# EAGLE schematic interfacez (EAGLE 6.4)
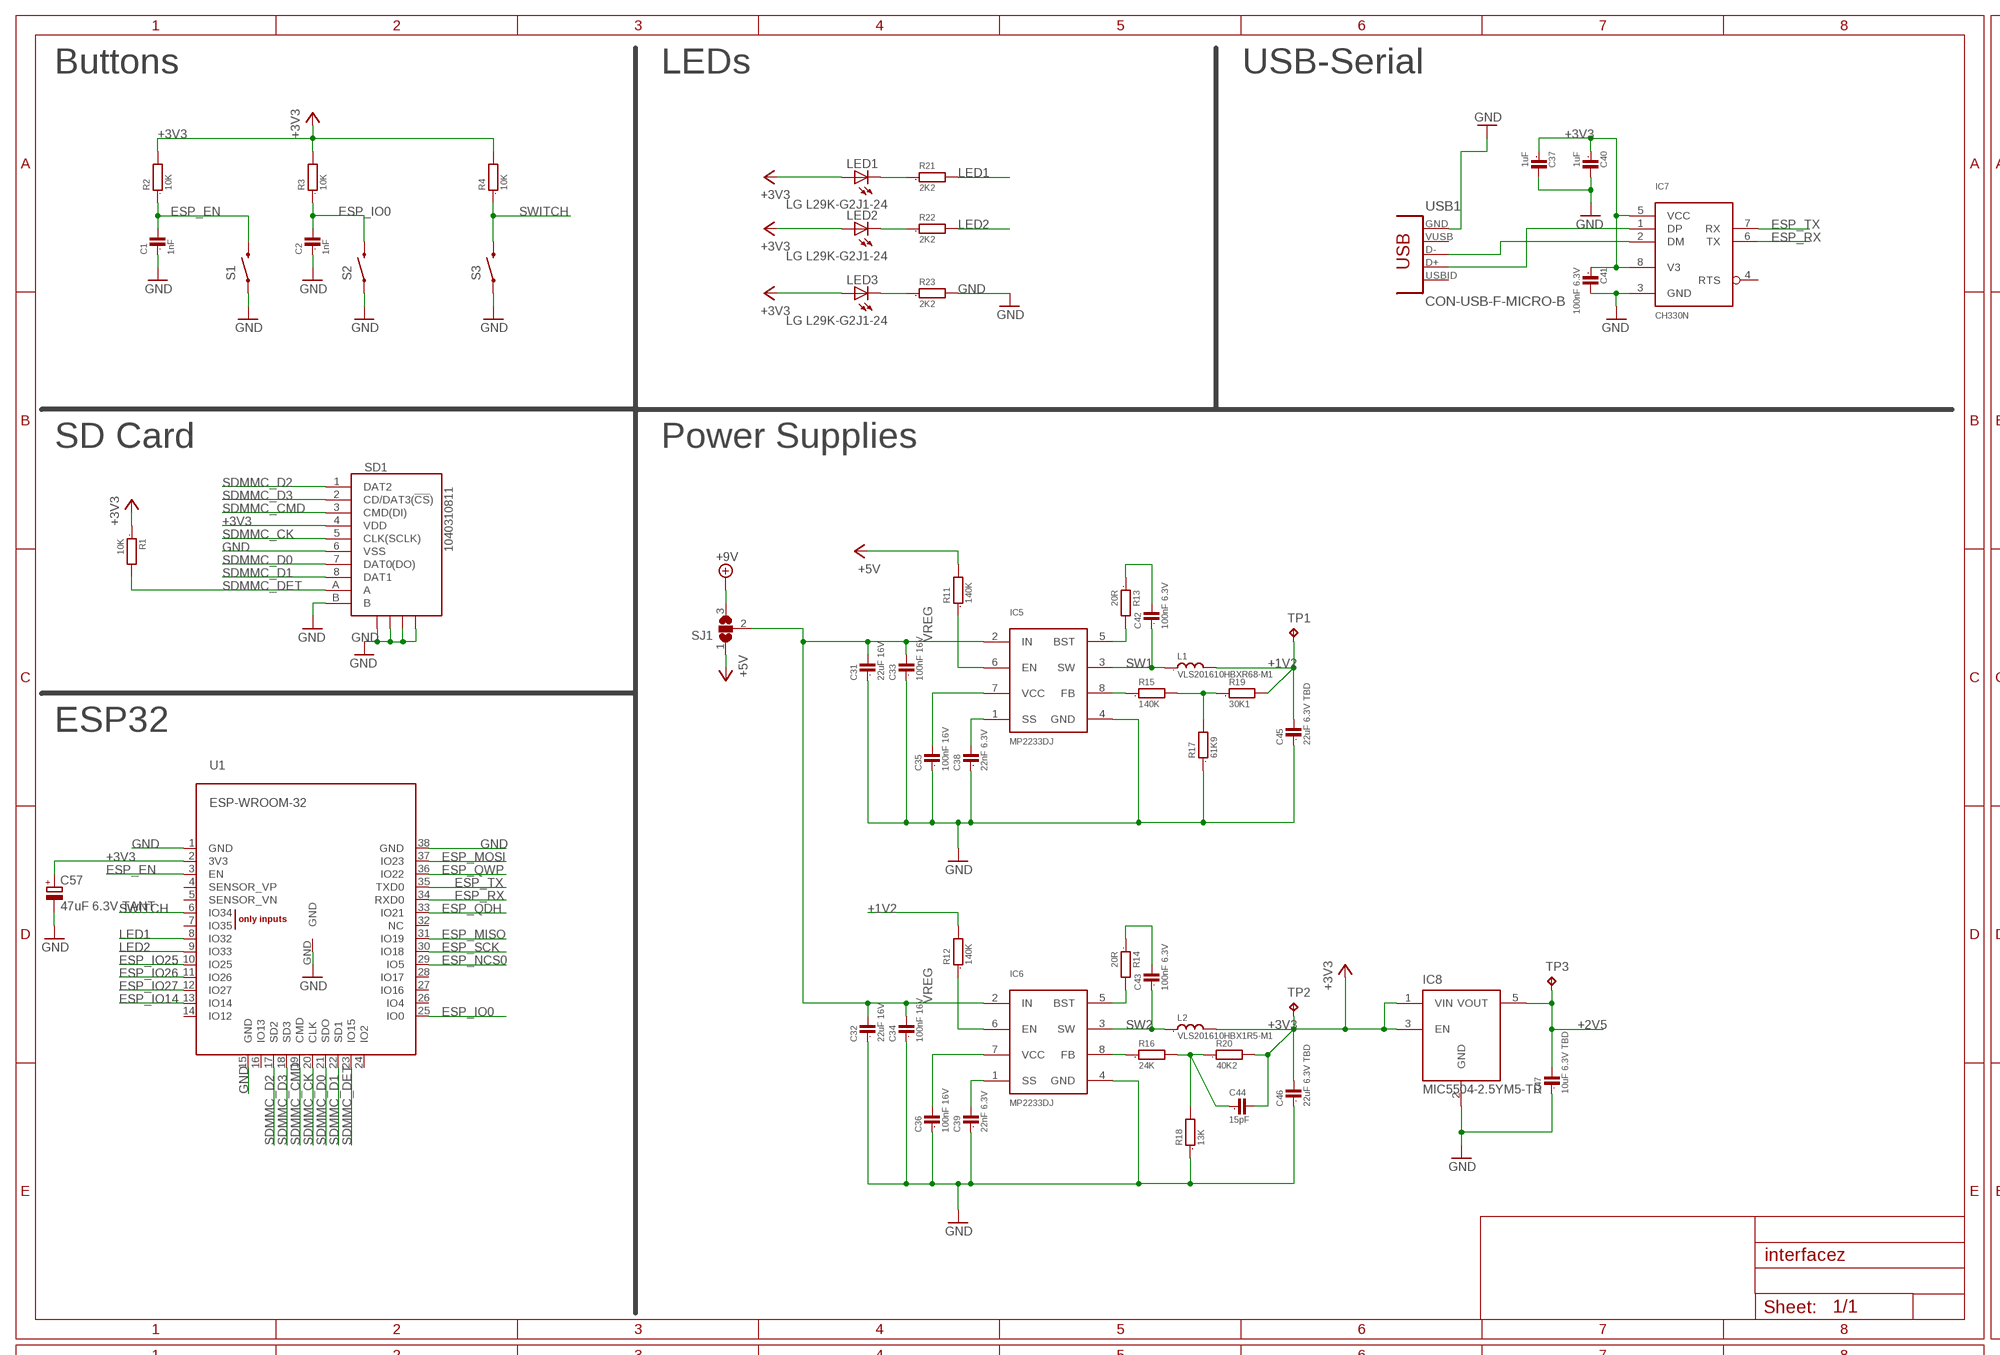
[diagram p0: schematic, sheet 1, part 1 of 3]
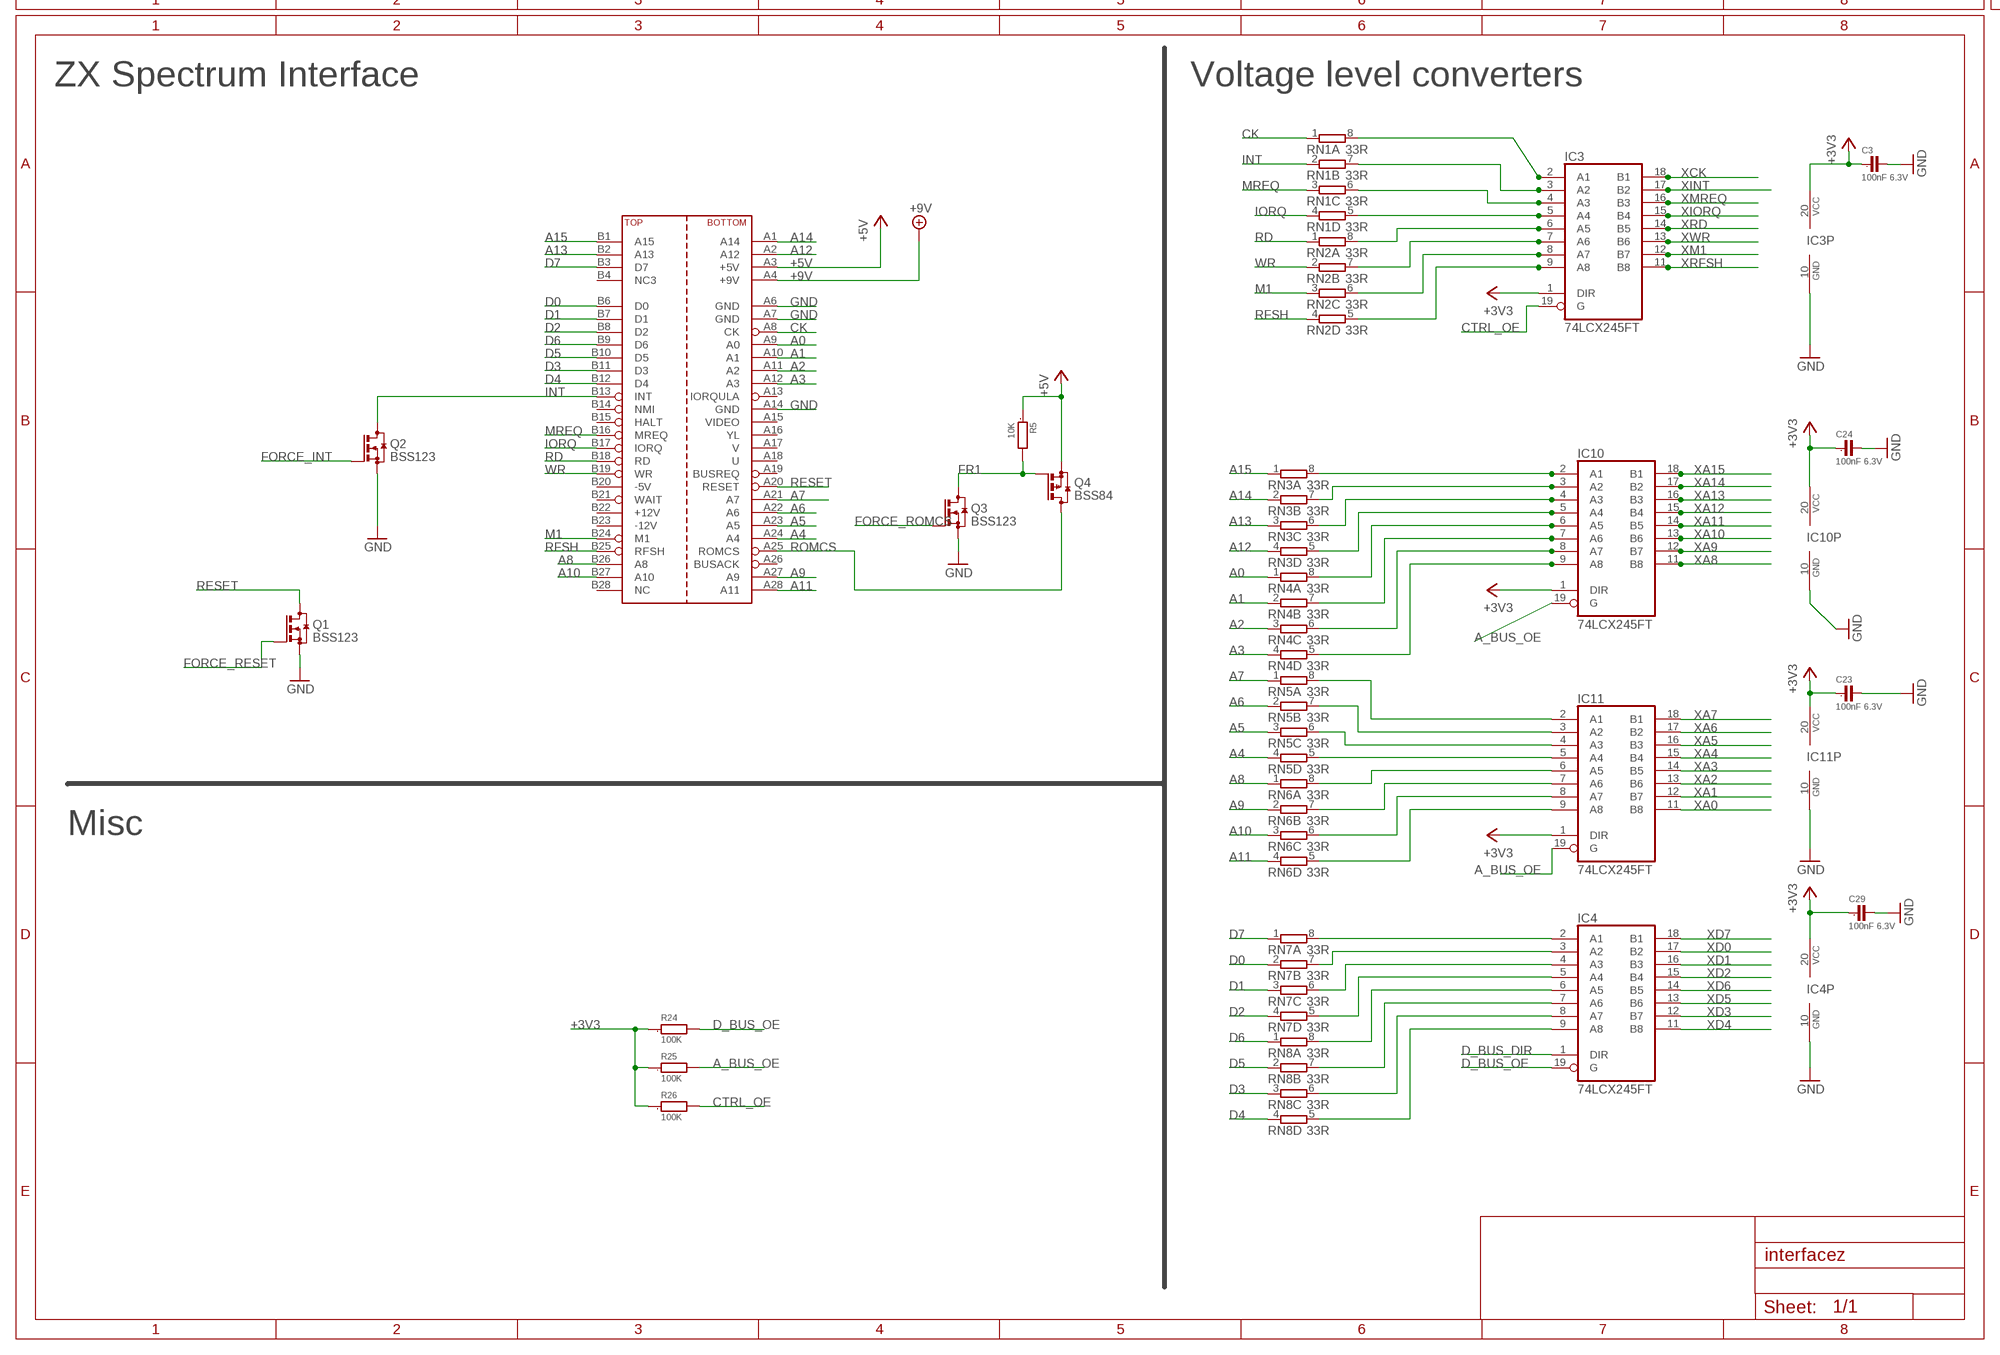
[diagram p1: schematic, sheet 1, part 2 of 3]
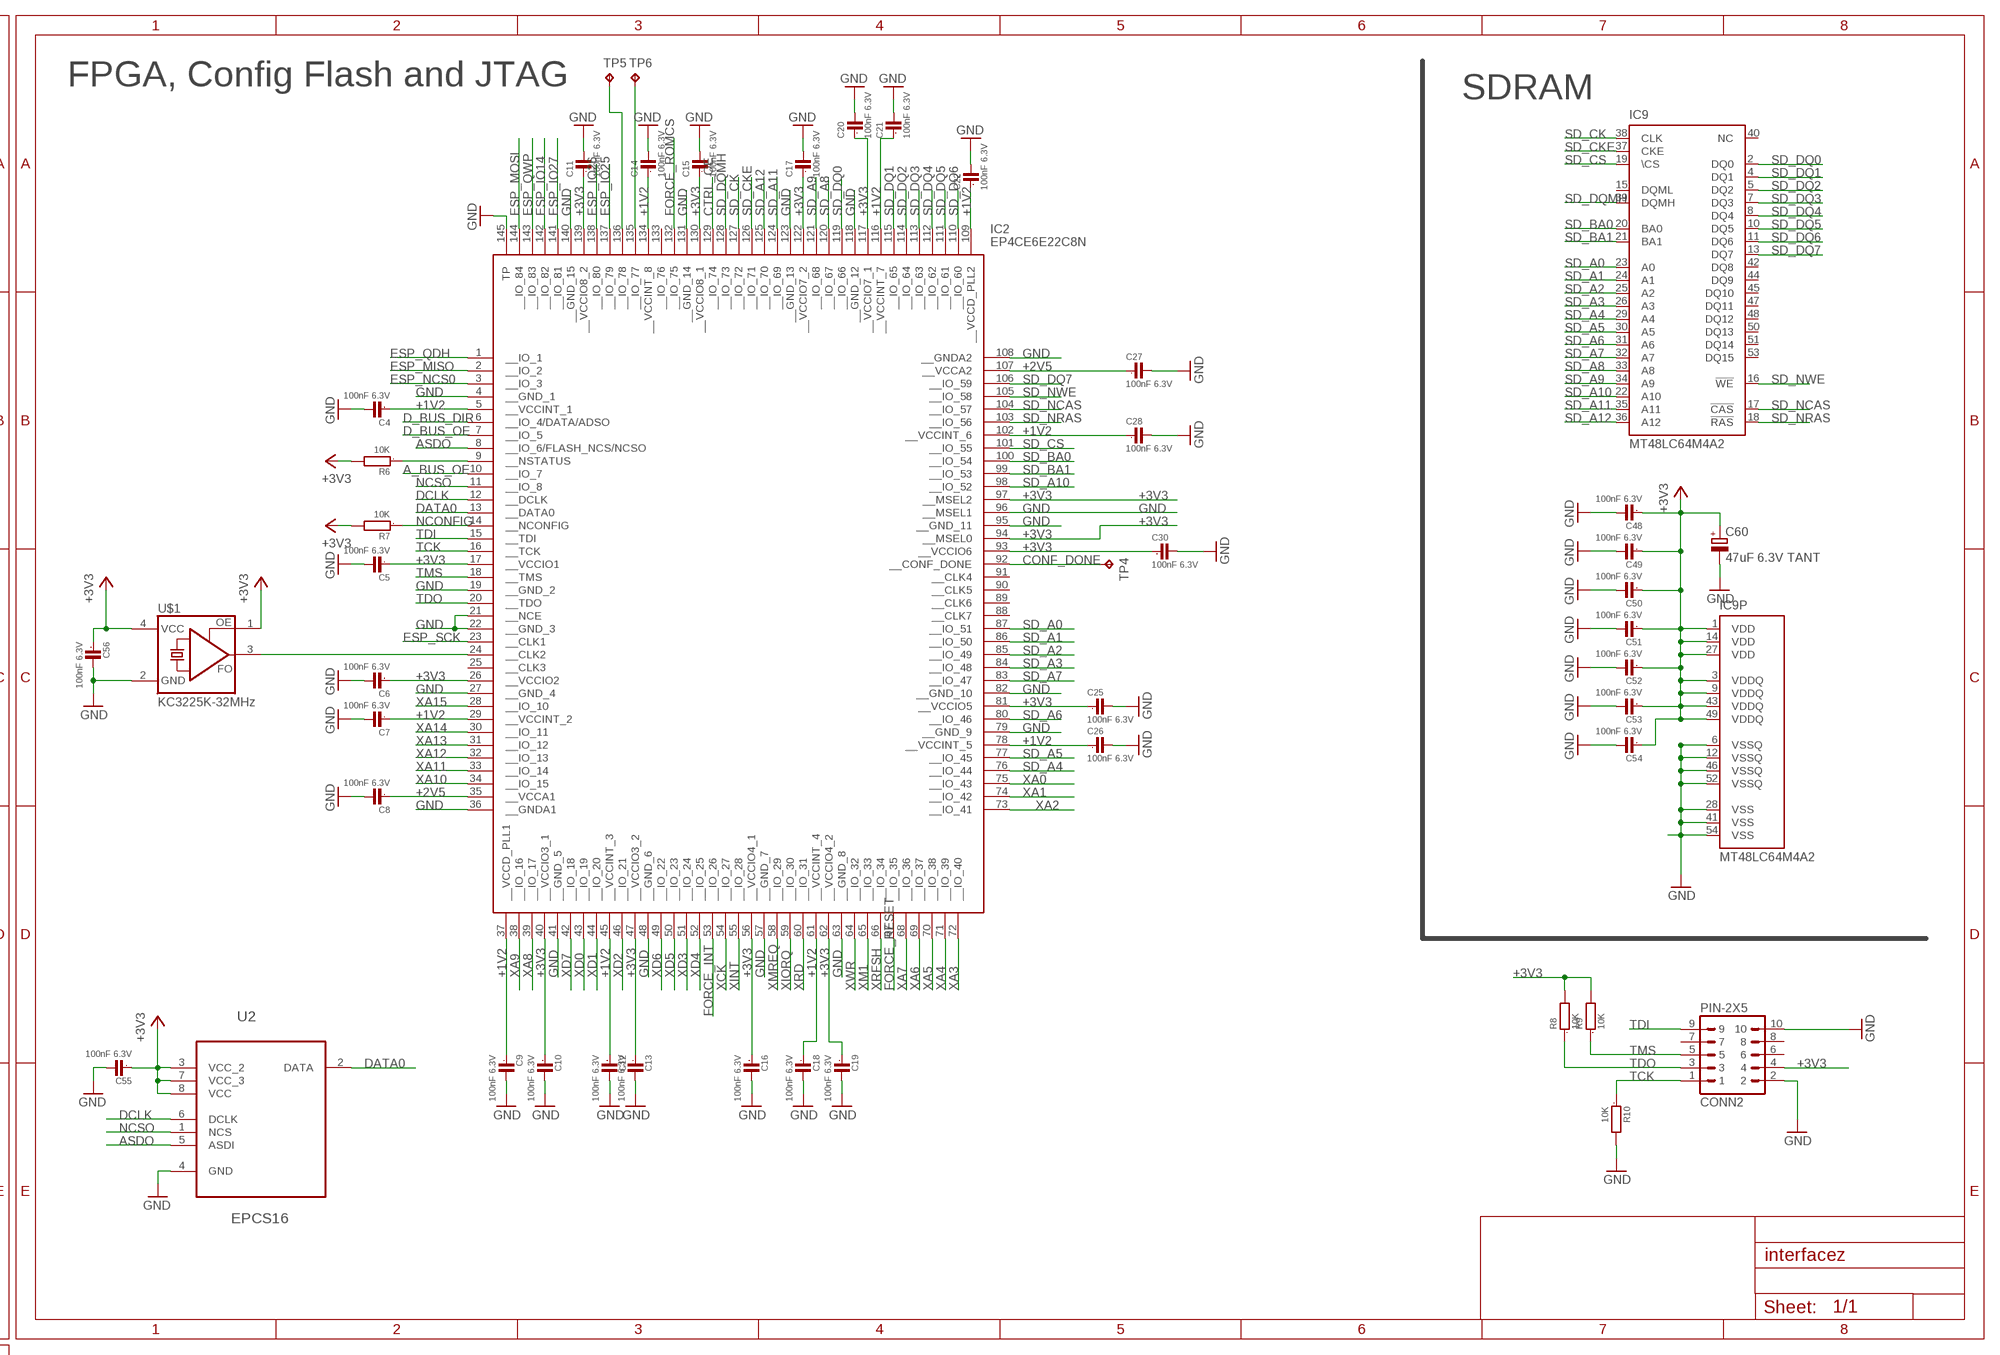
[diagram p2: schematic, sheet 1, part 3 of 3]

## Parts
C1  1nF  C0603  [0603]
C2  1nF  C0603  [0603]
C3  100nF 6.3V  C0603  [0603]
C4  100nF 6.3V  C0603  [0603]
C5  100nF 6.3V  C0603  [0603]
C6  100nF 6.3V  C0603  [0603]
C7  100nF 6.3V  C0603  [0603]
C8  100nF 6.3V  C0603  [0603]
C9  100nF 6.3V  C0603  [0603]
C10  100nF 6.3V  C0603  [0603]
C11  100nF 6.3V  C0603  [0603]
C12  100nF 6.3V  C0603  [0603]
C13  100nF 6.3V  C0603  [0603]
C14  100nF 6.3V  C0603  [0603]
C15  100nF 6.3V  C0603  [0603]
C16  100nF 6.3V  C0603  [0603]
C17  100nF 6.3V  C0603  [0603]
C18  100nF 6.3V  C0603  [0603]
C19  100nF 6.3V  C0603  [0603]
C20  100nF 6.3V  C0603  [0603]
C21  100nF 6.3V  C0603  [0603]
C22  100nF 6.3V  C0603  [0603]
C23  100nF 6.3V  C0603  [0603]
C24  100nF 6.3V  C0603  [0603]
C25  100nF 6.3V  C0603  [0603]
C26  100nF 6.3V  C0603  [0603]
C27  100nF 6.3V  C0603  [0603]
C28  100nF 6.3V  C0603  [0603]
C29  100nF 6.3V  C0603  [0603]
C30  100nF 6.3V  C0603  [0603]
C31  22uF 16V  C1210  [1210]
C32  22uF 16V  C1210  [1210]
C33  100nF 16V  C0603  [0603]
C34  100nF 16V  C0603  [0603]
C35  100nF 16V  C0603  [0603]
C36  100nF 16V  C0603  [0603]
C37  1uF  C0603  [0603]
C38  22nF 6.3V  C0603  [0603]
C39  22nF 6.3V  C0603  [0603]
C40  1uF  C0603  [0603]
C41  100nF 6.3V  C0603  [0603]
C42  100nF 6.3V  C0603  [0603]
C43  100nF 6.3V  C0603  [0603]
C44  15pF  C0603  [0603]
C45  22uF 6.3V TBD  C0805  [0805]
C46  22uF 6.3V TBD  C0805  [0805]
C47  10uF 6.3V TBD  C0805  [0805]
C48  100nF 6.3V  C0603  [0603]
C49  100nF 6.3V  C0603  [0603]
C50  100nF 6.3V  C0603  [0603]
C51  100nF 6.3V  C0603  [0603]
C52  100nF 6.3V  C0603  [0603]
C53  100nF 6.3V  C0603  [0603]
C54  100nF 6.3V  C0603  [0603]
C55  100nF 6.3V  C0603  [0603]
C56  100nF 6.3V  C0603  [0603]
C57  47uF 6.3V TANT  TANT_CASE_A  [TANT_CASE_A]
C60  47uF 6.3V TANT  TANT_CASE_A  [TANT_CASE_A]
CONN1  ZX_EDGE_DAUGHTERBOARD  [ZX-EDGE-DAUGHTERBOARD]
CONN2  PIN-2X5  [PIN-2X5]
IC2  EP4CE6E22C8N  [QFP50P2200X2200X165-145N]
IC3  74LCX245FT  74245  [TSSOP20]
IC4  74LCX245FT  74245  [TSSOP20]
IC5  MP2233DJ  [SOT23-8L]
IC6  MP2233DJ  [SOT23-8L]
IC7  CH330N  [SOIC8]
IC8  MIC5504-2.5YM5-TR  MIC550X  [SOT23-5L]
IC9  MT48LC64M4A2  [TSOP54-400]
IC10  74LCX245FT  74245  [TSSOP20]
IC11  74LCX245FT  74245  [TSSOP20]
L1  VLS201610HBXR68-M1  [IND_0806]
L2  VLS201610HBX1R5-M1  [IND_0806]
LED1  LG L29K-G2J1-24  LED-0603  [LED-603]
LED2  LG L29K-G2J1-24  LED-0603  [LED-603]
LED3  LG L29K-G2J1-24  LED-0603  [LED-603]
Q1  BSS123  [SOT23]
Q2  BSS123  [SOT23]
Q3  BSS123  [SOT23]
Q4  BSS84  [SOT23]
R1  10K  R0603  [0603]
R2  10K  R0603  [0603]
R3  10K  R0603  [0603]
R4  10K  R0603  [0603]
R5  10K  R0603  [0603]
R6  10K  R0603  [0603]
R7  10K  R0603  [0603]
R8  10K  R0603  [0603]
R9  10K  R0603  [0603]
R10  10K  R0603  [0603]
R11  140K  R0603  [0603]
R12  140K  R0603  [0603]
R13  20R  R0603  [0603]
R14  20R  R0603  [0603]
R15  140K  R0603  [0603]
R16  24K  R0603  [0603]
R17  61K9  R0603  [0603]
R18  13K  R0603  [0603]
R19  30K1  R0603  [0603]
R20  40K2  R0603  [0603]
R21  2K2  R0603  [0603]
R22  2K2  R0603  [0603]
R23  2K2  R0603  [0603]
R24  100K  R0603  [0603]
R25  100K  R0603  [0603]
R26  100K  R0603  [0603]
RN1  33R  4R-NEXB28V  [EXB28V]
RN2  33R  4R-NEXB28V  [EXB28V]
RN3  33R  4R-NEXB28V  [EXB28V]
RN4  33R  4R-NEXB28V  [EXB28V]
RN5  33R  4R-NEXB28V  [EXB28V]
RN6  33R  4R-NEXB28V  [EXB28V]
RN7  33R  4R-NEXB28V  [EXB28V]
RN8  33R  4R-NEXB28V  [EXB28V]
S1  SWITCHES_SMD-4  [TACTILE_SWITCH_TALL]
S2  SWITCHES_SMD-4  [TACTILE_SWITCH_TALL]
S3  SWITCHES_SMD-4  [TACTILE_SWITCH_TALL]
SD1  1040310811  [1040310811]
SJ1  SJ2W  [SJ_2]
TP1  TPTP12R  [TP12R]
TP2  TPTP12R  [TP12R]
TP3  TPTP12R  [TP12R]
TP4  TPTP08R  [TP08R]
TP5  TPTP12R  [TP12R]
TP6  TPTP12R  [TP12R]
U1  ESP-WROOM-32  [ESP-WROOM-32]
U2  EPCS16  EPCS1SI8N  [SOIC127P600X175-8N]
U$1  KC3225K-32MHz  KC3225K  [KC3225K]
USB1  CON-USB-F-MICRO-B  [CONN_USB_MICRO-B]

## Nets
+1V2: C4.1 C7.1 C9.1 C12.1 C14.1 C18.1 C21.1 C22.1 C26.1 C28.1 C45.2 IC2.5(__VCCINT_1) IC2.29(__VCCINT_2) IC2.37(__VCCD_PLL1) IC2.45(__VCCINT_3) IC2.61(__VCCINT_4) IC2.78(__VCCINT_5) IC2.102(__VCCINT_6) IC2.109(__VCCD_PLL2) IC2.116(__VCCINT_7) IC2.134(__VCCINT_8) L1.P$2 R12.2 R19.2 TP1.TP
+2V5: C8.1 C27.1 C47.2 IC2.35(__VCCA1) IC2.107(__VCCA2) IC8.5(VOUT) TP3.TP
+3V3: C3.1 C5.1 C6.1 C10.1 C11.1 C13.1 C15.1 C16.1 C17.1 C19.1 C20.1 C23.1 C24.1 C25.1 C29.1 C30.1 C37.1 C40.1 C41.1 C44.2 C46.2 C48.1 C49.1 C50.1 C51.1 C52.1 C53.1 C54.1 C55.1 C56.1 C57.PLUS(+) C60.PLUS(+) CONN2.4 IC2.17(__VCCIO1) IC2.26(__VCCIO2) IC2.40(__VCCIO3_1) IC2.47(__VCCIO3_2) IC2.56(__VCCIO4_1) IC2.62(__VCCIO4_2) IC2.81(__VCCIO5) IC2.93(__VCCIO6) IC2.94(__MSEL0) IC2.97(__MSEL2) IC2.117(__VCCIO7_1) IC2.122(__VCCIO7_2) IC2.130(__VCCIO8_1) IC2.139(__VCCIO8_2) IC3.1(DIR) IC3.20(VCC) IC4.20(VCC) IC7.5(VCC) IC7.8(V3) IC8.1(VIN) IC8.3(EN) IC9.1(VDD) IC9.3(VDDQ) IC9.9(VDDQ) IC9.14(VDD) IC9.27(VDD) IC9.43(VDDQ) IC9.49(VDDQ) IC10.1(DIR) IC10.20(VCC) IC11.1(DIR) IC11.20(VCC) L2.P$2 LED1.A LED2.A LED3.A R1.1 R2.2 R3.2 R4.2 R6.2 R7.2 R8.2 R9.2 R20.2 R24.1 R25.1 R26.1 SD1.4(VDD) TP2.TP U1.2(3V3) U2.3(VCC_2) U2.7(VCC_3) U2.8(VCC) U$1.1(OE) U$1.4(VCC)
+5V: CONN1.A3(+5V) Q4.2(S) R5.1 R11.2 SJ1.1
+9V: CONN1.A4(+9V) SJ1.3
A0: CONN1.A9(A0) RN4.1
A1: CONN1.A10(A1) RN4.2
A2: CONN1.A11(A2) RN4.3
A3: CONN1.A12(A3) RN4.4
A4: CONN1.A24(A4) RN5.4
A5: CONN1.A23(A5) RN5.3
A6: CONN1.A22(A6) RN5.2
A7: CONN1.A21(A7) RN5.1
A8: CONN1.B26(A8) RN6.1
A9: CONN1.A27(A9) RN6.2
A10: CONN1.B27(A10) RN6.3
A11: CONN1.A28(A11) RN6.4
A12: CONN1.A2(A12) RN3.4
A13: CONN1.B2(A13) RN3.3
A14: CONN1.A1(A14) RN3.2
A15: CONN1.B1(A15) RN3.1
A_BUS_OE: IC2.10(__IO_7) IC10.19(G) IC11.19(G) R25.2
ASDO: IC2.8(__IO_6/FLASH_NCS/NCSO) U2.5(ASDI)
CK: CONN1.A8(CK) RN1.1
CONF_DONE: IC2.92(__CONF_DONE) TP4.TP
CTRL_OE: IC2.129(__IO_74) IC3.19(G) R26.2
D0: CONN1.B6(D0) RN7.2
D1: CONN1.B7(D1) RN7.3
D2: CONN1.B8(D2) RN7.4
D3: CONN1.B11(D3) RN8.3
D4: CONN1.B12(D4) RN8.4
D5: CONN1.B10(D5) RN8.2
D6: CONN1.B9(D6) RN8.1
D7: CONN1.B3(D7) RN7.1
D_BUS_DIR: IC2.6(__IO_4/DATA/ADSO) IC4.1(DIR)
D_BUS_OE: IC2.7(__IO_5) IC4.19(G) R24.2
DATA0: IC2.13(__DATA0) U2.2(DATA)
DCLK: IC2.12(__DCLK) U2.6(DCLK)
ESP_EN: C1.2 R2.1 S1.B2 U1.3(EN)
ESP_IO0: C2.2 R3.1 S2.B2 U1.25(IO0)
ESP_IO14: IC2.142(__IO_82) U1.13(IO14)
ESP_IO25: IC2.137(__IO_79) U1.10(IO25)
ESP_IO26: IC2.138(__IO_80) U1.11(IO26)
ESP_IO27: IC2.141(__IO_81) U1.12(IO27)
ESP_MISO: IC2.2(__IO_2) U1.31(IO19)
ESP_MOSI: IC2.144(__IO_84) U1.37(IO23)
ESP_NCS0: IC2.3(__IO_3) U1.29(IO5)
ESP_QDH: IC2.1(__IO_1) U1.33(IO21)
ESP_QWP: IC2.143(__IO_83) U1.36(IO22)
ESP_RX: IC7.6(TX) U1.34(RXD0)
ESP_SCK: IC2.23(__CLK1) U1.30(IO18)
ESP_TX: IC7.7(RX) U1.35(TXD0)
FORCE_INT: IC2.53(__IO_26) Q2.1(G)
FORCE_RESET: IC2.67(__IO_35) Q1.1(G)
FORCE_ROMCS: IC2.132(__IO_75) Q3.1(G)
FR1: Q3.3(D) Q4.1(G) R5.2
GND: C1.1 C2.1 C3.2 C4.2 C5.2 C6.2 C7.2 C8.2 C9.2 C10.2 C11.2 C12.2 C13.2 C14.2 C15.2 C16.2 C17.2 C18.2 C19.2 C20.2 C21.2 C22.2 C23.2 C24.2 C25.2 C26.2 C27.2 C28.2 C29.2 C30.2 C31.1 C32.1 C33.1 C34.1 C35.1 C36.1 C37.2 C38.1 C39.1 C40.2 C41.2 C45.1 C46.1 C47.1 C48.2 C49.2 C50.2 C51.2 C52.2 C53.2 C54.2 C55.2 C56.2 C57.MINUS(-) C60.MINUS(-) CONN1.A6(GND) CONN1.A7(GND) CONN1.A14(GND) CONN2.2 CONN2.10 IC2.4(__GND_1) IC2.19(__GND_2) IC2.21(__NCE) IC2.22(__GND_3) IC2.27(__GND_4) IC2.36(__GNDA1) IC2.41(__GND_5) IC2.48(__GND_6) IC2.57(__GND_7) IC2.63(__GND_8) IC2.79(__GND_9) IC2.82(__GND_10) IC2.95(__GND_11) IC2.96(__MSEL1) IC2.108(__GNDA2) IC2.118(__GND_12) IC2.123(__GND_13) IC2.131(__GND_14) IC2.140(__GND_15) IC2.145(TP) IC3.10(GND) IC4.10(GND) IC5.4(GND) IC6.4(GND) IC7.3(GND) IC8.2(GND) IC9.6(VSSQ) IC9.12(VSSQ) IC9.28(VSS) IC9.41(VSS) IC9.46(VSSQ) IC9.52(VSSQ) IC9.54(VSS) IC10.10(GND) IC11.10(GND) Q1.2(S) Q2.2(S) Q3.2(S) R10.2 R17.1 R18.1 R23.2 S1.A2 S2.A2 S3.A2 SD1.6(VSS) SD1.B SD1.MNT1(S1) SD1.MNT2(S2) SD1.MNT3(S3) SD1.MNT4(S4) U1.1(GND) U1.15(GND) U1.38(GND) U1.GND U2.4(GND) U$1.2(GND) USB1.P5(GND)
INT: CONN1.B13(INT) Q2.3(D) RN1.2
IORQ: CONN1.B17(IORQ) RN1.4
LED1: R21.2 U1.8(IO32)
LED2: R22.2 U1.9(IO33)
M1: CONN1.B24(M1) RN2.3
MREQ: CONN1.B16(MREQ) RN1.3
N$1: IC2.9(__NSTATUS) R6.1
N$2: LED1.C R21.1
N$3: LED2.C R22.1
N$4: LED3.C R23.1
N$5: IC2.136(__IO_78) TP5.TP
N$6: IC2.135(__IO_77) TP6.TP
N$7: IC3.2(A1) RN1.8
N$8: IC3.3(A2) RN1.7
N$9: IC10.2(A1) RN3.8
N$10: IC10.3(A2) RN3.7
N$11: IC10.4(A3) RN3.6
N$12: IC10.5(A4) RN3.5
N$13: IC2.24(__CLK2) U$1.3(FO)
N$14: IC10.6(A5) RN4.8
N$15: IC10.7(A6) RN4.7
N$16: IC4.2(A1) RN7.8
N$17: IC4.3(A2) RN7.7
N$18: IC10.8(A7) RN4.6
N$19: IC6.5(BST) R14.2
N$21: C43.2 R14.1
N$22: IC10.9(A8) RN4.5
N$23: IC11.2(A1) RN5.8
N$24: IC11.3(A2) RN5.7
N$25: IC11.4(A3) RN5.6
N$26: IC11.5(A4) RN5.5
N$27: IC11.6(A5) RN6.8
N$28: IC11.7(A6) RN6.7
N$29: IC11.8(A7) RN6.6
N$30: IC11.9(A8) RN6.5
N$31: IC4.4(A3) RN7.6
N$32: IC4.5(A4) RN7.5
N$33: IC4.6(A5) RN8.8
N$34: IC4.7(A6) RN8.7
N$35: IC4.8(A7) RN8.6
N$36: IC4.9(A8) RN8.5
N$37: IC3.4(A3) RN1.6
N$38: IC3.5(A4) RN1.5
N$39: IC3.6(A5) RN2.8
N$40: IC3.7(A6) RN2.7
N$41: IC3.8(A7) RN2.6
N$42: IC3.9(A8) RN2.5
N$43: C39.2 IC6.1(SS)
N$44: IC5.5(BST) R13.2
N$45: C36.2 IC6.7(VCC)
N$46: C42.2 R13.1
N$47: C38.2 IC5.1(SS)
N$48: C35.2 IC5.7(VCC)
N$49: IC6.8(FB) R16.1
N$50: C44.1 R16.2 R18.2 R20.1
N$51: IC5.8(FB) R15.1
N$52: IC6.6(EN) R12.1
N$53: R15.2 R17.2 R19.1
N$54: IC5.6(EN) R11.1
N$149: IC7.1(DP) USB1.P3(D+)
N$150: IC7.2(DM) USB1.P2(D-)
NCONFIG: IC2.14(__NCONFIG) R7.1
NCSO: IC2.11(__IO_8) U2.1(NCS)
RD: CONN1.B18(RD) RN2.1
RESET: CONN1.A20(RESET) Q1.3(D)
RFSH: CONN1.B25(RFSH) RN2.4
ROMCS: CONN1.A25(ROMCS) Q4.3(D)
SD_A0: IC2.87(__IO_51) IC9.23(A0)
SD_A1: IC2.86(__IO_50) IC9.24(A1)
SD_A2: IC2.85(__IO_49) IC9.25(A2)
SD_A3: IC2.84(__IO_48) IC9.26(A3)
SD_A4: IC2.76(__IO_44) IC9.29(A4)
SD_A5: IC2.77(__IO_45) IC9.30(A5)
SD_A6: IC2.80(__IO_46) IC9.31(A6)
SD_A7: IC2.83(__IO_47) IC9.32(A7)
SD_A8: IC2.120(__IO_67) IC9.33(A8)
SD_A9: IC2.121(__IO_68) IC9.34(A9)
SD_A10: IC2.98(__IO_52) IC9.22(A10)
SD_A11: IC2.124(__IO_69) IC9.35(A11)
SD_A12: IC2.125(__IO_70) IC9.36(A12)
SD_BA0: IC2.100(__IO_54) IC9.20(BA0)
SD_BA1: IC2.99(__IO_53) IC9.21(BA1)
SD_CK: IC2.127(__IO_72) IC9.38(CLK)
SD_CKE: IC2.126(__IO_71) IC9.37(CKE)
SD_CS: IC2.101(__IO_55) IC9.19(\CS)
SD_DQ0: IC2.119(__IO_66) IC9.2(DQ0)
SD_DQ1: IC2.115(__IO_65) IC9.4(DQ1)
SD_DQ2: IC2.114(__IO_64) IC9.5(DQ2)
SD_DQ3: IC2.113(__IO_63) IC9.7(DQ3)
SD_DQ4: IC2.112(__IO_62) IC9.8(DQ4)
SD_DQ5: IC2.111(__IO_61) IC9.10(DQ5)
SD_DQ6: IC2.110(__IO_60) IC9.11(DQ6)
SD_DQ7: IC2.106(__IO_59) IC9.13(DQ7)
SD_DQMH: IC2.128(__IO_73) IC9.39(DQMH)
SD_NCAS: IC2.104(__IO_57) IC9.17(!CAS)
SD_NRAS: IC2.103(__IO_56) IC9.18(!RAS)
SD_NWE: IC2.105(__IO_58) IC9.16(!WE)
SDMMC_CK: SD1.5(CLK(SCLK)) U1.20(CLK)
SDMMC_CMD: SD1.3(CMD(DI)) U1.19(CMD)
SDMMC_D0: SD1.7(DAT0(DO)) U1.21(SDO)
SDMMC_D1: SD1.8(DAT1) U1.22(SD1)
SDMMC_D2: SD1.1(DAT2) U1.17(SD2)
SDMMC_D3: SD1.2(CD/DAT3(!CS!)) U1.18(SD3)
SDMMC_DET: R1.2 SD1.A U1.23(IO15)
SW1: C42.1 IC5.3(SW) L1.P$1
SW2: C43.1 IC6.3(SW) L2.P$1
SWITCH: R4.1 S3.B2 U1.6(IO34)
TCK: CONN2.1 IC2.16(__TCK) R10.1
TDI: CONN2.9 IC2.15(__TDI)
TDO: CONN2.3 IC2.20(__TDO) R8.1
TMS: CONN2.5 IC2.18(__TMS) R9.1
VREG: C31.2 C32.2 C33.2 C34.2 IC5.2(IN) IC6.2(IN) SJ1.2
WR: CONN1.B19(WR) RN2.2
XA0: IC2.75(__IO_43) IC11.11(B8)
XA1: IC2.74(__IO_42) IC11.12(B7)
XA2: IC2.73(__IO_41) IC11.13(B6)
XA3: IC2.72(__IO_40) IC11.14(B5)
XA4: IC2.71(__IO_39) IC11.15(B4)
XA5: IC2.70(__IO_38) IC11.16(B3)
XA6: IC2.69(__IO_37) IC11.17(B2)
XA7: IC2.68(__IO_36) IC11.18(B1)
XA8: IC2.39(__IO_17) IC10.11(B8)
XA9: IC2.38(__IO_16) IC10.12(B7)
XA10: IC2.34(__IO_15) IC10.13(B6)
XA11: IC2.33(__IO_14) IC10.14(B5)
XA12: IC2.32(__IO_13) IC10.15(B4)
XA13: IC2.31(__IO_12) IC10.16(B3)
XA14: IC2.30(__IO_11) IC10.17(B2)
XA15: IC2.28(__IO_10) IC10.18(B1)
XCK: IC2.54(__IO_27) IC3.18(B1)
XD0: IC2.43(__IO_19) IC4.17(B2)
XD1: IC2.44(__IO_20) IC4.16(B3)
XD2: IC2.46(__IO_21) IC4.15(B4)
XD3: IC2.51(__IO_24) IC4.12(B7)
XD4: IC2.52(__IO_25) IC4.11(B8)
XD5: IC2.50(__IO_23) IC4.13(B6)
XD6: IC2.49(__IO_22) IC4.14(B5)
XD7: IC2.42(__IO_18) IC4.18(B1)
XINT: IC2.55(__IO_28) IC3.17(B2)
XIORQ: IC2.59(__IO_30) IC3.15(B4)
XM1: IC2.65(__IO_33) IC3.12(B7)
XMREQ: IC2.58(__IO_29) IC3.16(B3)
XRD: IC2.60(__IO_31) IC3.14(B5)
XRFSH: IC2.66(__IO_34) IC3.11(B8)
XWR: IC2.64(__IO_32) IC3.13(B6)
Unconnected: CONN1.A13(IORQULA) CONN1.A15(VIDEO) CONN1.A16(YL) CONN1.A17(V) CONN1.A18(U) CONN1.A19(BUSREQ) CONN1.A26(BUSACK) CONN1.B4(NC3) CONN1.B14(NMI) CONN1.B15(HALT) CONN1.B21(WAIT) CONN1.B28(NC) CONN2.6 CONN2.7 CONN2.8 IC2.25(__CLK3) IC2.88(__CLK7) IC2.89(__CLK6) IC2.90(__CLK5) IC2.91(__CLK4) IC2.133(__IO_76) IC7.4(RTS) IC9.15(DQML) IC9.40(NC) IC9.42(DQ8) IC9.44(DQ9) IC9.45(DQ10) IC9.47(DQ11) IC9.48(DQ12) IC9.50(DQ13) IC9.51(DQ14) IC9.53(DQ15) U1.4(SENSOR_VP) U1.5(SENSOR_VN) U1.7(IO35) U1.14(IO12) U1.16(IO13) U1.24(IO2) U1.26(IO4) U1.27(IO16) U1.28(IO17) U1.32(NC) USB1.BODY@1(BODY) USB1.BODY@2(BODY) USB1.BODY@3(BODY) USB1.BODY@4(BODY) USB1.P1(VUSB) USB1.P4(USBID)

## Notes on the sheet
- Buttons | LEDs | USB-Serial
- FPGA, Config Flash and JTAG
- SDRAM
- SD Card | Power Supplies
- ESP32
- ZX Spectrum Interface | Voltage level converters
- Misc

## Power pins joined to a net without a drawn wire
+12V: CONN1.B22(+12V)
-5V: CONN1.B20(-5V)
-12V: CONN1.B23(-12V)

## Library data of the parts
C1-C56 = GadgetFactory:C: CAPACITOR, European symbol
C57 C60 = alvie:TANT_CASE_A
CONN1 = zxspectrum:ZX_EDGE_DAUGHTERBOARD
CONN2 = alvie:PIN-2X5
IC2 = SamacSys_Parts:EP4CE6E22C8N: FPGA Cyclone IV 6272 Cells TQFP144 EP4CE6E22C8N, FPGA Cyclone IV E 6272 Cells, 270kbit, 392 Blocks, 1.15 1.25 V 144-Pin EQFP Source: Datasheet <https://componentsearchengine.com/Datasheets/1/EP4CE6E22C8N.pdf>; DESCRIPTION: FPGA Cyclone IV 6272 Cells TQFP144 EP4CE6E22C8N, FPGA Cyclone IV E 6272 Cells, 270kbit, 392 Blocks, 1.15 1.25 V 144-Pin EQFP; HEIGHT: 1.65mm; MANUFACTURER_NAME: Intel; MANUFACTURER_PART_NUMBER: EP4CE6E22C8N; MOUSER_PART_NUMBER: 989-EP4CE6E22C8N; MOUSER_PRICE-STOCK: https://www.mouser.com/Search/Refine.aspx?Keyword=989-EP4CE6E22C8N
IC3 IC4 IC10 IC11 = GadgetFactory:74*245: Octal BUS TRANSCEIVER, 3-state
IC5 IC6 = alvie:MP2233
IC7 = alvie:CH330N
IC8 = alvie:MIC550X
IC9 = memory-micron:MT48LC64M4A2: 256Mb: x16 SDRAM MT48LC64M4A2 - 16 Meg x 4 x 4 banks Source: http://download.micron.com/pdf/datasheets/dram/sdram/256MSDRAM.pdf; OC_FARNELL: unknown; OC_NEWARK: unknown
L1 L2 = alvie:VLS201610HBX
LED1-LED3 = dp_devices:LED: Light Emitting Diode
Q1-Q3 = transistor-small-signal:BSS123: N-CHANNEL MOS FET
Q4 = transistor-small-signal:BSS84: P-CHANNEL MOS FET
R1-R26 = GadgetFactory:R: RESISTOR, European symbol
RN1-RN8 = resistor-dil:4R-N: Array Chip Resistor Source: RS Component / Phycomp; OC_FARNELL: unknown; OC_NEWARK: unknown
S1-S3 = EAGLE_BoosterPack_Library:SWITCHES_: Various NO switches- pushbuttons, reed, etc
SD1 = alvie:1040310811
SJ1 = jumper:SJ2W: SMD solder JUMPER
TP1-TP6 = testpad:TP: Test pad
U1 = esp32:ESP-WROOM-32
U2 = Altera_By_element14_Batch_1:EPCS1SI8N: Serial Configuration Devices; DESCRIPTION: Serial Configuration Devices; MPN: EPCS1SI8N; OC_FARNELL: 1453504; OC_NEWARK: 51R0466; PACKAGE: SOIC-8; SUPPLIER: ALTERA
U$1 = alvie:KC3225K
USB1 = dp_devices:CON-USB-F: USB Female connector